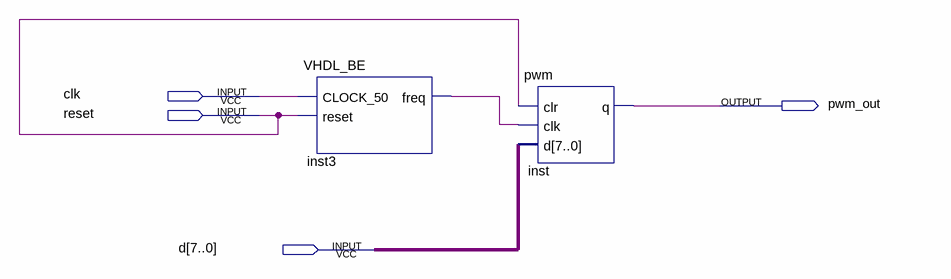
[diagram p0: schematic sheet]
// Quartus schematic blk.bdf as structural Verilog: 2 symbols, 4 pins
module blk (
  input  clk,
  input  reset,
  input  [7:0] d,
  output pwm_out
);

  wire inst3_freq;

  VHDL_BE inst3 (.CLOCK_50(clk), .reset(reset), .freq(inst3_freq));
  pwm inst (.clr(reset), .clk(inst3_freq), .d(d), .q(pwm_out));
endmodule
